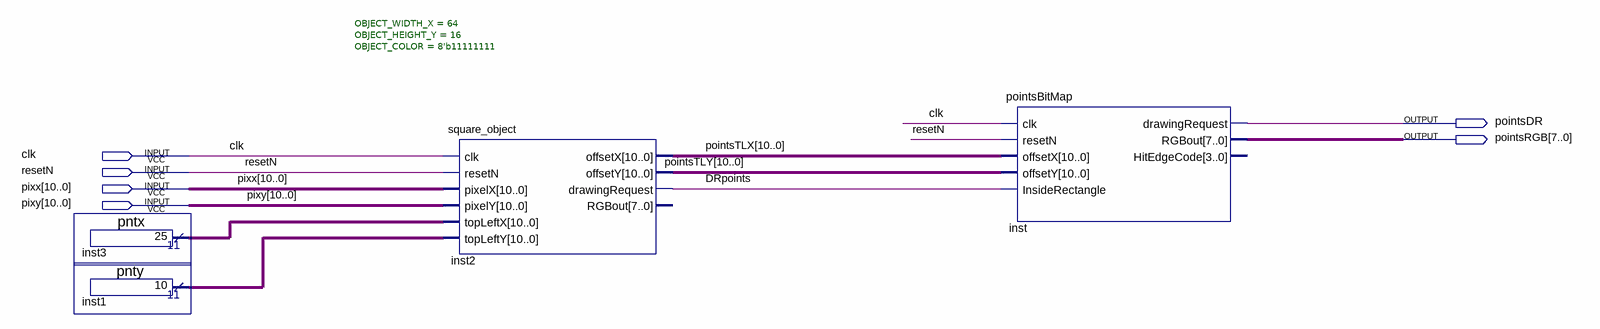
[diagram p0: schematic sheet]
// Quartus schematic pointsDisplay.bdf as structural Verilog: 4 symbols, 6 pins
module pointsDisplay (
  input  clk,
  input  resetN,
  input  [10:0] pixx,
  input  [10:0] pixy,
  output pointsDR,
  output [7:0] pointsRGB
);

  wire DRpoints;
  wire [10:0] inst1_result, inst3_result, pointsTLX, pointsTLY;

  pntx inst3 (.result(inst3_result));
  pnty inst1 (.result(inst1_result));
  square_object #(.OBJECT_WIDTH_X(64), .OBJECT_HEIGHT_Y(16), .OBJECT_COLOR(8'b11111111)) inst2 (
    .clk(clk), .resetN(resetN), .pixelX(pixx), .pixelY(pixy), .topLeftX(inst3_result),
    .topLeftY(inst1_result), .offsetX(pointsTLX), .offsetY(pointsTLY), .drawingRequest(DRpoints));  // open: RGBout
  pointsBitMap inst (
    .clk(clk), .resetN(resetN), .offsetX(pointsTLX), .offsetY(pointsTLY), .InsideRectangle(DRpoints),
    .drawingRequest(pointsDR), .RGBout(pointsRGB));  // open: HitEdgeCode
endmodule
